# Altium schematic sheet ADC.SchDoc: ADC
size Letter; CheckedBy: J. Brinton; CompanyName: Signal Laboratories, Inc.; DrawnBy: J. Brinton; Engineer: J. Brinton; Address1: 3479 Edison Way; Address2: Menlo Park CA 94025; Address3: +1 (877) 778-8435; Address4: siglabs.com; Revision: 3; SheetNumber: 18; SheetTotal: 49
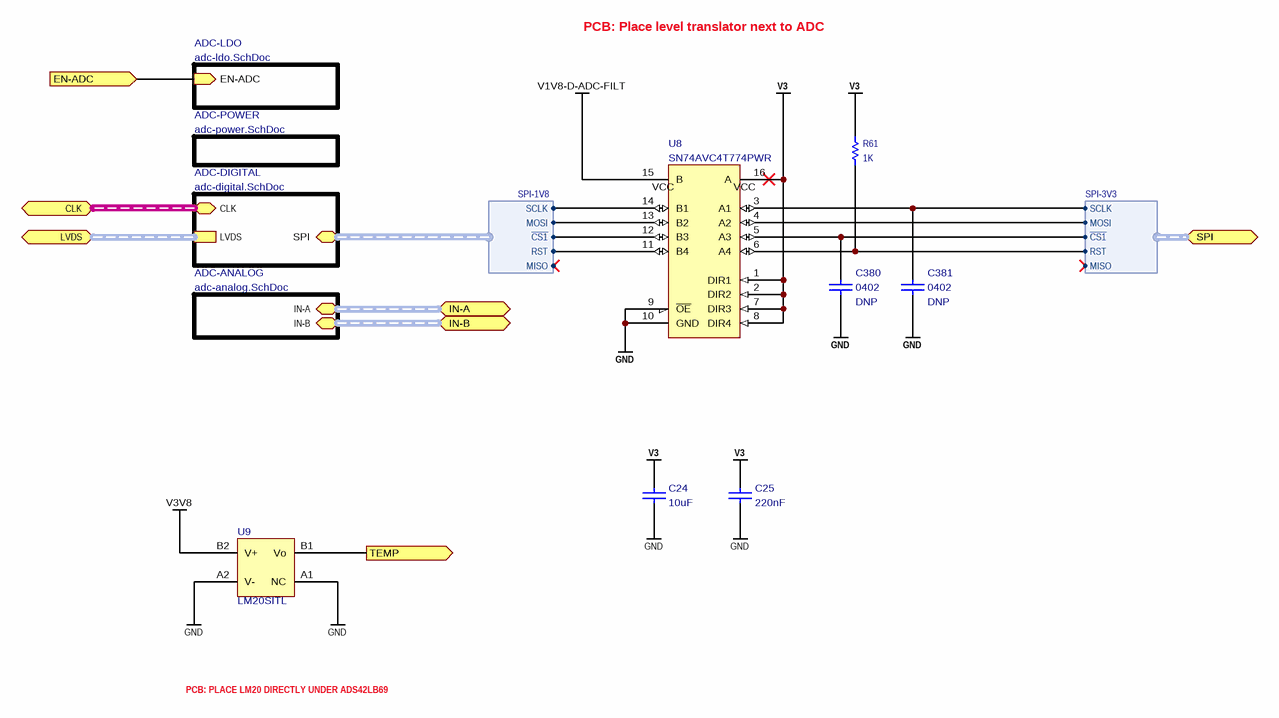
[diagram p0: ADC.SchDoc]

## Parts
C24  value 10uF  [CAPC200X125X145L45N]  (hidden comment: CL21B106KOQNNNE)
C25  value 220nF  [CAPC100X50X55L25N]  (hidden comment: C1005X7R1E224K050BE)
C380  Package: 0402  Do Not Place: DNP  [CAPC100X50X55L25N]  (hidden comment: VJ0402A101KXA)
C381  Package: 0402  Do Not Place: DNP  [CAPC100X50X55L25N]  (hidden comment: VJ0402A101KXA)
R61  value 1K  [RESC1005X40N]  (hidden comment: RC0402FR-071KL)
U8  SN74AVC4T774PWR  [TSSOP16]
U9  LM20SITL  [YZR-4]

## Sub-sheets
ADC-ANALOG = adc-analog.SchDoc: IN-B (harness DIFF100), IN-A (harness DIFF100)
ADC-DIGITAL = adc-digital.SchDoc: LVDS (harness ADC-LVDS), CLK (harness CLK-LVPECL33-TERM), SPI (harness SPI-1V8)
ADC-LDO = adc-ldo.SchDoc: EN-ADC (in)
ADC-POWER = adc-power.SchDoc: no entries

## Ports
CLK (harness CLK-LVPECL33-TERM), EN-ADC (in), IN-A (harness DIFF100), IN-B (harness DIFF100), LVDS (harness ADC-LVDS), SPI (harness SPI-3V3), TEMP (out)

## Harnesses
SPI-1V8: MOSI, MISO, SCLK, ~{CS1}, RST
SPI-3V3: MOSI, MISO, SCLK, ~{CS1}, RST

## Nets
GND: C24.2 C25.2 C380.2 C381.2 U8.9(~{OE}) U8.10(GND) U9.A1(NC) U9.A2(V-)
V1V8-D-ADC-FILT: U8.15(B)
V3: C24.1 C25.1 R61.2 U8.1(DIR1) U8.2(DIR2) U8.7(DIR3) U8.8(DIR4) U8.16(A)
V3V8: U9.B2(V+)
EN-ADC: port EN-ADC, sheet ADC-LDO/EN-ADC
TEMP: U9.B1(Vo) ; port TEMP
NetC380_1: C380.1 U8.5(A3) ; port SPI.~{CS1}
NetC381_1: C381.1 U8.3(A1) ; port SPI.SCLK
NetR61_1: R61.1 U8.6(A4) ; port SPI.RST
NetU8_4: U8.4(A2) ; port SPI.MOSI
NetU8_11: U8.11(B4) ; sheet ADC-DIGITAL/SPI.RST
NetU8_12: U8.12(B3) ; sheet ADC-DIGITAL/SPI.~{CS1}
NetU8_13: U8.13(B2) ; sheet ADC-DIGITAL/SPI.MOSI
NetU8_14: U8.14(B1) ; sheet ADC-DIGITAL/SPI.SCLK

## Buses and harness runs
harness port CLK = sheet ADC-DIGITAL/CLK
harness port IN-A = sheet ADC-ANALOG/IN-A
harness port IN-B = sheet ADC-ANALOG/IN-B
harness port LVDS = sheet ADC-DIGITAL/LVDS

## Notes on the sheet
- PCB: Place level translator next to ADC
- PCB: PLACE LM20 DIRECTLY UNDER ADS42LB69
- Title
- Engineer
- Revision
- Drawn By
- Checked By
- Date
- Sheet
- of
- (in symbol SN74AVC4T774PWR) VCC

## Library data of the parts
C24 = LMK212B7106KG: Ceramic Capacitor 10uF ±10% 16V X7R 0805; Manufacturer: Samsung; Tr: -55:105; Manufacturer P/N: CL21B106KOQNNNE; Tolerance: ±10%; Package: 0805; Voltage: 16V
C25 = TMK105B7224KV: Ceramic Capacitor 220nF ±10% 25V X7R 0402; Manufacturer: TDK; Manufacturer P/N: C1005X7R1E224K050BE; Tolerance: ±10%; Tr: *; Package: 0402; Voltage: 25V
C380 C381 = VJ0402A101JXA: Ceramic Capacitor 100pF ±10% 50V C0G 0402; Manufacturer: Vishay; Tr: -55:150; Manufacturer P/N: VJ0402A101KXA; Tolerance: ±10%; Value: 100pF; Voltage: 50V
R61 = RES 0402: Thick Film Resistor 1k ±1% 0402; Manufacturer: Yageo; Tr: -55:155; Package: 0402; Manufacturer P/N: RC0402FR-071KL; Do Not Place: *; Tolerance: ±1%
U8 = SN74AVC4T774PWR: 4-Bit Dual-Supply Bus Transceiver; Manufacturer: Texas Instruments; Manufacturer P/N: SN74AVC4T774PWR
U9 = LM20SITL: Analog Temperature Sensor; Manufacturer: Texas Instruments; Manufacturer P/N: LM20SITL; Package: DSBGA-4